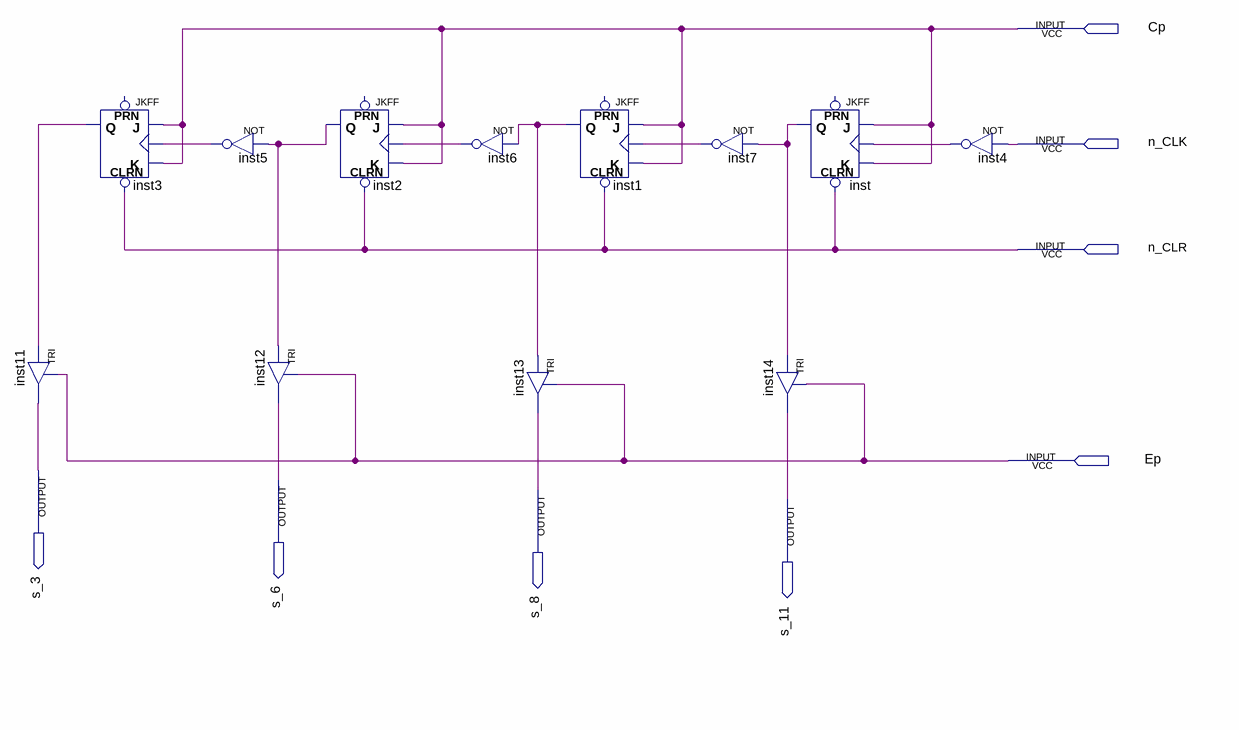
[diagram p0: schematic sheet]
// Quartus schematic ContadordeProgramasNovo.bdf as structural Verilog: 12 symbols, 8 pins
module ContadordeProgramasNovo (
  input  Cp,
  input  n_CLK,
  input  n_CLR,
  input  Ep,
  output s_3,
  output s_6,
  output s_8,
  output s_11
);

  wire inst1_q, inst2_q, inst3_q, inst4_out, inst5_out, inst6_out, inst7_out, inst_q;

  TRI inst11 (.IN(inst3_q), .OE(Ep), .OUT(s_3));
  JKFF inst3 (.CLRN(n_CLR), .K(Cp), .J(Cp), .CLK(inst5_out), .Q(inst3_q));  // open: PRN
  not inst5 (inst5_out, inst2_q);
  TRI inst12 (.IN(inst2_q), .OE(Ep), .OUT(s_6));
  JKFF inst2 (.CLRN(n_CLR), .K(Cp), .J(Cp), .CLK(inst6_out), .Q(inst2_q));  // open: PRN
  not inst6 (inst6_out, inst1_q);
  JKFF inst1 (.CLRN(n_CLR), .K(Cp), .J(Cp), .CLK(inst7_out), .Q(inst1_q));  // open: PRN
  TRI inst13 (.IN(inst1_q), .OE(Ep), .OUT(s_8));
  not inst7 (inst7_out, inst_q);
  JKFF inst (.CLRN(n_CLR), .K(Cp), .J(Cp), .CLK(inst4_out), .Q(inst_q));  // open: PRN
  TRI inst14 (.IN(inst_q), .OE(Ep), .OUT(s_11));
  not inst4 (inst4_out, n_CLK);
endmodule
